# Altium schematic sheet IMU.SchDoc: IMU Sensor
size A4; DrawnBy: Ivan Seidel; ProjectName: Soccer B Robot
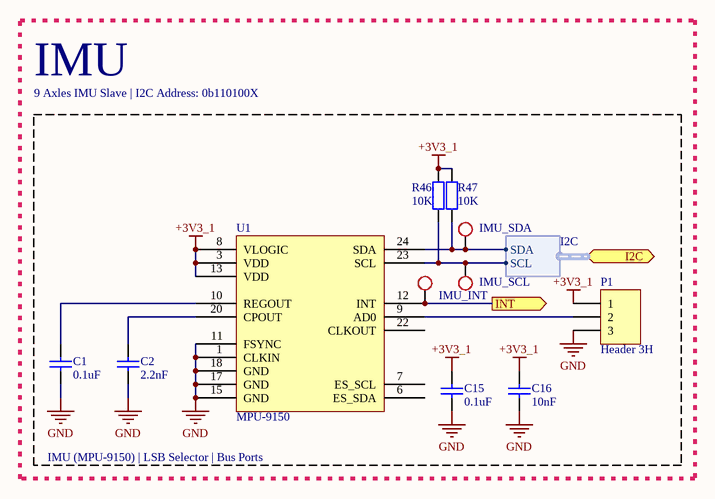
[diagram p0: IMU.SchDoc]

## Parts
C1  0.1uF  [C0805]
C2  2.2nF  [C0805]
C15  0.1uF  [C0805]
C16  10nF  [C0805]
IMU_INT  Test Point  [TP1]  (value not drawn)  (no BOM)
IMU_SCL  Test Point  [TP1]  (value not drawn)  (no BOM)
IMU_SDA  Test Point  [TP1]  (value not drawn)  (no BOM)
P1  Header 3H  [HDR1X3H]
R46  10K  [RES1206]
R47  10K  [RES1206]
U1  MPU-9150  [LGA-24]

## Ports
I2C (harness I2C), INT (out)

## Harnesses
I2C: SCL, SDA

## Nets
+3V3_1: C15.2 C16.2 P1.1 R46.1 R47.1 U1.3(VDD) U1.8(VLOGIC) U1.13(VDD)
GND: C1.1 C2.1 C15.1 C16.1 P1.3 U1.1(CLKIN) U1.11(FSYNC) U1.15(GND) U1.17(GND) U1.18(GND)
INT: IMU_INT.1 U1.12(INT) ; port INT
NetC1_2: C1.2 U1.10(REGOUT)
NetC2_2: C2.2 U1.20(CPOUT)
NetIMU_SCL_1: IMU_SCL.1 R46.2 U1.23(SCL) ; port I2C.SCL
NetIMU_SDA_1: IMU_SDA.1 R47.2 U1.24(SDA) ; port I2C.SDA
NetP1_2: P1.2 U1.9(AD0)

Not connected (* = marked no-connect by the designer): U1 6(ES_SDA) 7(ES_SCL) 22(CLKOUT)

## Notes on the sheet
- IMU
- 9 Axles IMU Slave | I2C Address: 0b110100X
- IMU (MPU-9150) | LSB Selector | Bus Ports

## Library data of the parts
C1 C2 C15 C16 = Cap Semi: Capacitor (Semiconductor SIM Model); Published: 8-Jun-2000; LatestRevisionDate: 29-May-2009; LatestRevisionNote: IPC-7351 Footprint Added.; PackageReference: C1206; Publisher: Altium Limited; PackageDescription: Chip Capacitor
  C1 C15: Value: 0.1uF
  C2: Value: 2.2nF
  C16: Value: 10nF
IMU_INT IMU_SCL IMU_SDA = Test Point: Test Point for Osciloscope measurements
P1 = Header 3H: Header, 3-Pin, Right Angle; LatestRevisionDate: 17-Jul-2002; LatestRevisionNote: Re-released for DXP Platform.; Publisher: Altium Limited
R46 R47 = RES
U1 = MPU-9150: InveSense MPU-9150 IMU 9 axles